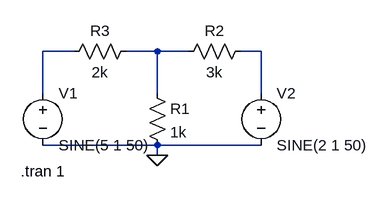
[diagram p0: schematic Q3.asc]
Q3.asc, the LTspice schematic file:
Version 4
SHEET 1 880 680
WIRE 96 64 48 64
WIRE 224 64 176 64
WIRE 272 64 224 64
WIRE 384 64 352 64
WIRE 48 128 48 64
WIRE 224 128 224 64
WIRE 384 128 384 64
WIRE 224 208 48 208
WIRE 384 208 224 208
WIRE 224 224 224 208
FLAG 224 224 0
SYMBOL voltage 48 112 R0
WINDOW 123 0 0 Left 0
WINDOW 39 0 0 Left 0
SYMATTR InstName V1
SYMATTR Value SINE(5 1 50)
SYMBOL voltage 384 112 R0
WINDOW 123 0 0 Left 0
WINDOW 39 0 0 Left 0
SYMATTR InstName V2
SYMATTR Value SINE(2 1 50)
SYMBOL res 208 112 R0
SYMATTR InstName R1
SYMATTR Value 1k
SYMBOL res 368 48 R90
WINDOW 0 0 56 VBottom 2
WINDOW 3 32 56 VTop 2
SYMATTR InstName R2
SYMATTR Value 3k
SYMBOL res 192 48 R90
WINDOW 0 0 56 VBottom 2
WINDOW 3 32 56 VTop 2
SYMATTR InstName R3
SYMATTR Value 2k
TEXT 14 248 Left 2 !.tran 1

The netlist it stands for:
* Q3.asc
V1 N001 0 SINE(5 1 50)
V2 N003 0 SINE(2 1 50)
R1 N002 0 1k
R2 N003 N002 3k
R3 N002 N001 2k
.tran 1
.backanno
.end